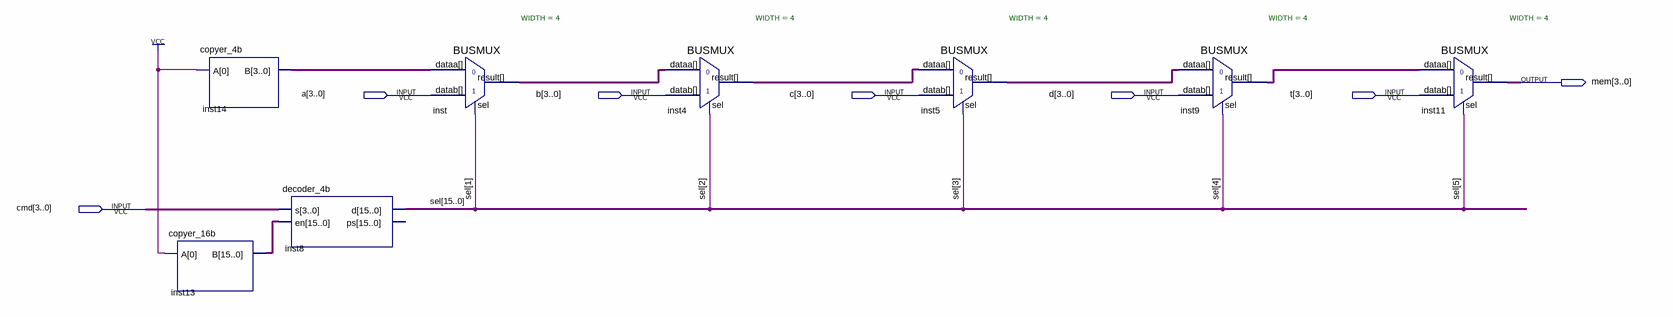
[diagram p0: schematic sheet]
// Quartus schematic mem.bdf as structural Verilog: 8 symbols, 7 pins
module mem (
  input  [3:0] a,
  input  [3:0] b,
  input  [3:0] c,
  input  [3:0] d,
  input  [3:0] t,
  input  [3:0] cmd,
  output [3:0] mem
);

  wire [3:0] inst4_result, inst5_result, inst9_result, inst14_b, inst_result;
  wire [15:0] inst13_b, sel;

  copyer_16b inst13 (.A(1'b1), .B(inst13_b));
  copyer_4b inst14 (.A(1'b1), .B(inst14_b));
  decoder_4b inst8 (.s(cmd), .en(inst13_b), .d(sel));  // open: ps
  BUSMUX #(.WIDTH(4)) inst (.datab(a), .sel(sel[1]), .dataa(inst14_b), .result(inst_result));
  BUSMUX #(.WIDTH(4)) inst4 (.datab(b), .sel(sel[2]), .dataa(inst_result), .result(inst4_result));
  BUSMUX #(.WIDTH(4)) inst5 (.datab(c), .sel(sel[3]), .dataa(inst4_result), .result(inst5_result));
  BUSMUX #(.WIDTH(4)) inst9 (.datab(d), .sel(sel[4]), .dataa(inst5_result), .result(inst9_result));
  BUSMUX #(.WIDTH(4)) inst11 (.datab(t), .sel(sel[5]), .dataa(inst9_result), .result(mem));
endmodule
